# EAGLE schematic Driver_Low_Side_2A_ZXMN3A01F (EAGLE 6.5.0)
Single Channel MOSFET Driver ZXMN3A01F <http://www.mouser.com/ds/2/115/ZXMN3A01F-95785.pdf> Connect PWM_X to the PWMxx pin on the microcontroller Connect DRIVER_OUT_X to load
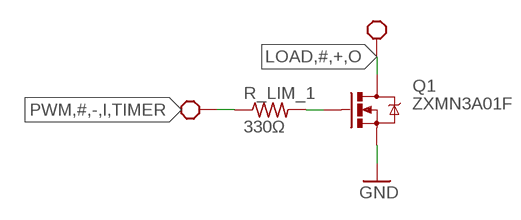
[diagram p0: schematic, sheet 1]

## Parts
Q1  ZXMN3A01F  MOSFET-NCHANNELSMD  [SOT23-3]
R_LIM_1  330Ω  R-US_R0603  [R0603]

## Nets
GATE_1: Q1.1(G) R_LIM_1.2
GND: Q1.2(S)
LOAD,#,+,O: Q1.3(D) ; supply symbol labelled BLOCK_REQUIREMENT
PWM,#,-,I,TIMER: R_LIM_1.1 ; supply symbol labelled BLOCK_REQUIREMENT

## Library data of the parts
Q1 = SparkFun-DiscreteSemi:MOSFET-NCHANNEL: Generic NMOS footprint
R_LIM_1 = resistor:R-US_: RESISTOR, American symbol

## Net classes
0 default: width 0.178 mm, drill 0.381 mm, clearance 0.178 mm